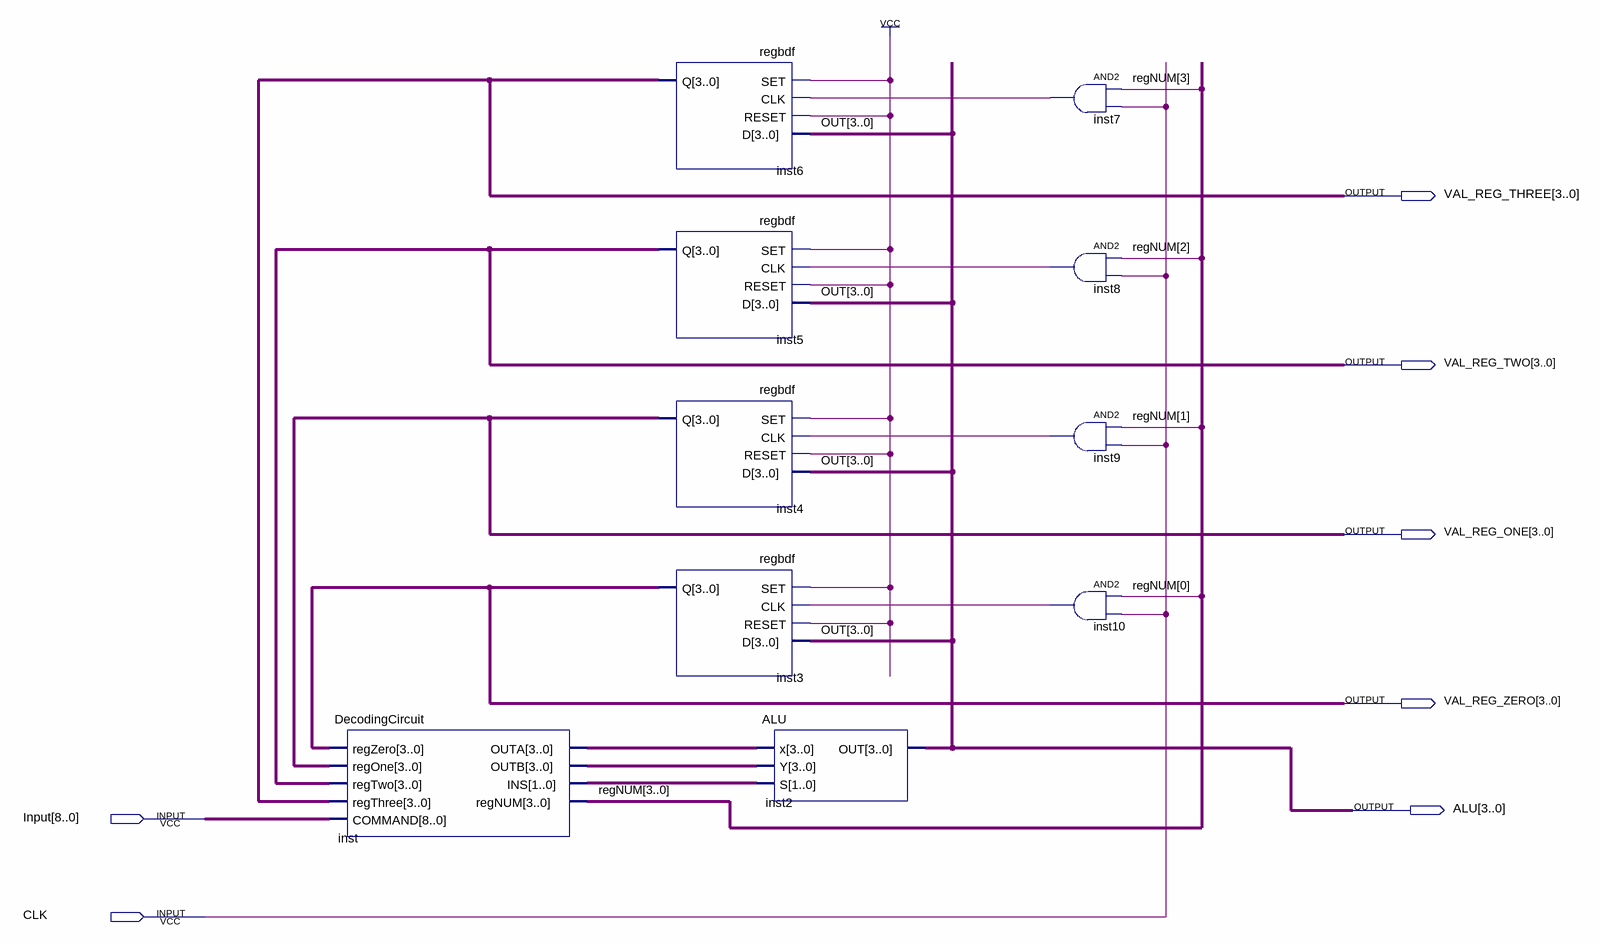
[diagram p0: schematic sheet]
// Quartus schematic EU.bdf as structural Verilog: 10 symbols, 7 pins
module EU (
  input  [8:0] Input,
  input  CLK,
  output [3:0] VAL_REG_THREE,
  output [3:0] VAL_REG_TWO,
  output [3:0] VAL_REG_ONE,
  output [3:0] VAL_REG_ZERO,
  output [3:0] ALU
);

  wire inst7_out, inst8_out, inst9_out, inst10_out;
  wire [1:0] inst_ins;
  wire [3:0] inst_outa, inst_outb, regNUM;

  DecodingCircuit inst (
    .regZero(VAL_REG_ZERO), .regOne(VAL_REG_ONE), .regTwo(VAL_REG_TWO), .regThree(VAL_REG_THREE),
    .COMMAND(Input), .OUTA(inst_outa), .OUTB(inst_outb), .INS(inst_ins), .regNUM(regNUM));
  regbdf inst6 (.SET(1'b1), .CLK(inst7_out), .RESET(1'b1), .D(ALU), .Q(VAL_REG_THREE));
  regbdf inst5 (.SET(1'b1), .CLK(inst8_out), .RESET(1'b1), .D(ALU), .Q(VAL_REG_TWO));
  regbdf inst4 (.SET(1'b1), .CLK(inst9_out), .RESET(1'b1), .D(ALU), .Q(VAL_REG_ONE));
  regbdf inst3 (.SET(1'b1), .CLK(inst10_out), .RESET(1'b1), .D(ALU), .Q(VAL_REG_ZERO));
  ALU inst2 (.x(inst_outa), .Y(inst_outb), .S(inst_ins), .OUT(ALU));
  and inst7 (inst7_out, regNUM[3], CLK);
  and inst8 (inst8_out, regNUM[2], CLK);
  and inst9 (inst9_out, regNUM[1], CLK);
  and inst10 (inst10_out, regNUM[0], CLK);

  // Other names for the same wires on the sheet: OUT[3:0] = ALU
endmodule
